# Altium schematic sheet 07_Connector.SchDoc
size A3; SheetNumber: 7; SheetTotal: 7
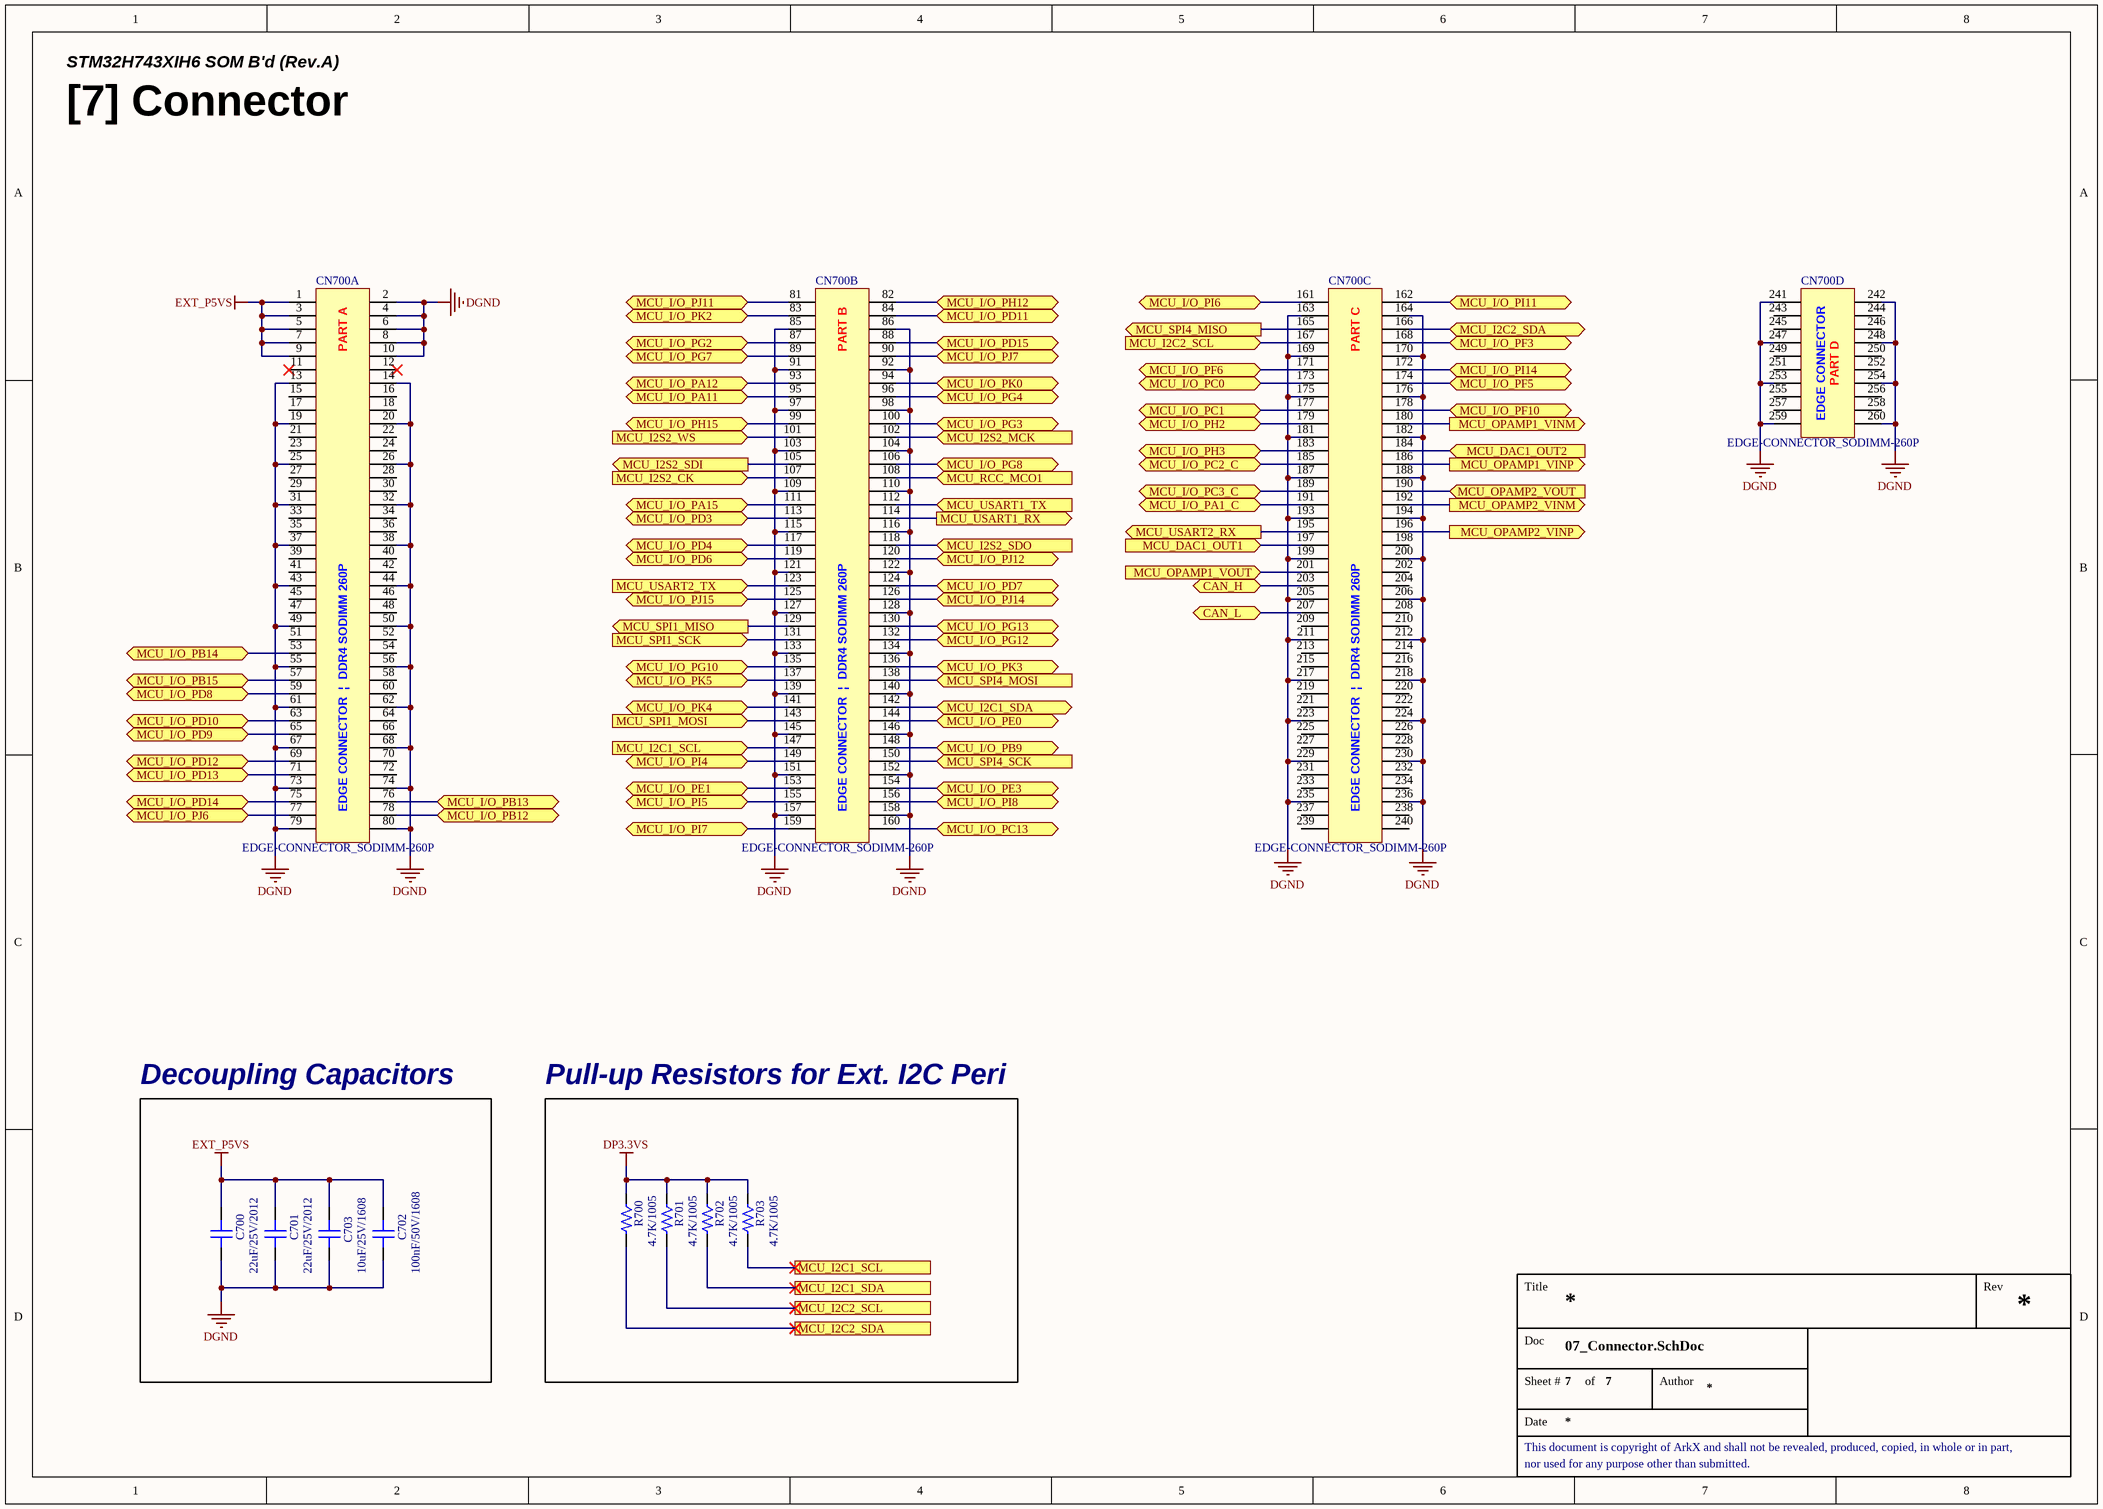
[diagram p0: 07_Connector.SchDoc]

## Parts
C700  22uF/25V/2012  [CAP 2012 (0805_INCH)]
C701  22uF/25V/2012  [CAP 2012 (0805_INCH)]
C702  100nF/50V/1608  [CAP 1608 (0603_INCH)]
C703  10uF/25V/1608  [CAP 1608 (0603_INCH)]
CN700  EDGE-CONNECTOR_SODIMM-260P  [CON_EDGE-CONNECTOR_DDR4-SODIMM-260P]  (parts A,B,C,D of 4)
R700  4.7K/1005  [RES 1005 (0402_inch)]
R701  4.7K/1005  [RES 1005 (0402_inch)]
R702  4.7K/1005  [RES 1005 (0402_inch)]
R703  4.7K/1005  [RES 1005 (0402_inch)]

## Blocks framed on the sheet
Decoupling Capacitors: C700-C703
Pull-up Resistors for Ext. I2C Peri: R700-R703

## Ports
CAN_H (bidir), CAN_L (bidir), MCU_DAC1_OUT1 (in), MCU_DAC1_OUT2 (in), MCU_I2C1_SCL, MCU_I2C1_SCL (in), MCU_I2C1_SDA, MCU_I2C1_SDA (bidir), MCU_I2C2_SCL, MCU_I2C2_SCL (in), MCU_I2C2_SDA, MCU_I2C2_SDA (bidir), MCU_I2S2_CK (in), MCU_I2S2_MCK (in), MCU_I2S2_SDI (out), MCU_I2S2_SDO (in), MCU_I2S2_WS (in), MCU_I/O_PA1_C (bidir), MCU_I/O_PA11 (bidir), MCU_I/O_PA12 (bidir), MCU_I/O_PA15 (bidir), MCU_I/O_PB9 (bidir), MCU_I/O_PB12 (bidir), MCU_I/O_PB13 (bidir), MCU_I/O_PB14 (bidir), MCU_I/O_PB15 (bidir), MCU_I/O_PC0 (bidir), MCU_I/O_PC1 (bidir), MCU_I/O_PC2_C (bidir), MCU_I/O_PC3_C (bidir), MCU_I/O_PC13 (bidir), MCU_I/O_PD3 (bidir), MCU_I/O_PD4 (bidir), MCU_I/O_PD6 (bidir), MCU_I/O_PD7 (bidir), MCU_I/O_PD8 (bidir), MCU_I/O_PD9 (bidir), MCU_I/O_PD10 (bidir), MCU_I/O_PD11 (bidir), MCU_I/O_PD12 (bidir), MCU_I/O_PD13 (bidir), MCU_I/O_PD14 (bidir), MCU_I/O_PD15 (bidir), MCU_I/O_PE0 (bidir), MCU_I/O_PE1 (bidir), MCU_I/O_PE3 (bidir), MCU_I/O_PF3 (bidir), MCU_I/O_PF5 (bidir), MCU_I/O_PF6 (bidir), MCU_I/O_PF10 (bidir), MCU_I/O_PG2 (bidir), MCU_I/O_PG3 (bidir), MCU_I/O_PG4 (bidir), MCU_I/O_PG7 (bidir), MCU_I/O_PG8 (bidir), MCU_I/O_PG10 (bidir), MCU_I/O_PG12 (bidir), MCU_I/O_PG13 (bidir), MCU_I/O_PH2 (bidir), MCU_I/O_PH3 (bidir), MCU_I/O_PH12 (bidir), MCU_I/O_PH15 (bidir), MCU_I/O_PI4 (bidir), MCU_I/O_PI5 (bidir), MCU_I/O_PI6 (bidir), MCU_I/O_PI7 (bidir), MCU_I/O_PI8 (bidir), MCU_I/O_PI11 (bidir), MCU_I/O_PI14 (bidir), MCU_I/O_PJ6 (bidir), MCU_I/O_PJ7 (bidir), MCU_I/O_PJ11 (bidir), MCU_I/O_PJ12 (bidir), MCU_I/O_PJ14 (bidir), MCU_I/O_PJ15 (bidir), MCU_I/O_PK0 (bidir), MCU_I/O_PK2 (bidir), MCU_I/O_PK3 (bidir), MCU_I/O_PK4 (bidir), MCU_I/O_PK5 (bidir), MCU_OPAMP1_VINM (out), MCU_OPAMP1_VINP (out), MCU_OPAMP1_VOUT (in), MCU_OPAMP2_VINM (out), MCU_OPAMP2_VINP (out), MCU_OPAMP2_VOUT (in), MCU_RCC_MCO1 (in), MCU_SPI1_MISO (out), MCU_SPI1_MOSI (in), MCU_SPI1_SCK (in), MCU_SPI4_MISO (out), MCU_SPI4_MOSI (in), MCU_SPI4_SCK (in), MCU_USART1_RX (out), MCU_USART1_TX (in), MCU_USART2_RX (out), MCU_USART2_TX (in)

## Nets
DGND: C700.1 C701.1 C702.1 C703.1 CN700.2 CN700.4 CN700.6 CN700.8 CN700.10 CN700.13 CN700.14 CN700.19 CN700.20 CN700.25 CN700.26 CN700.31 CN700.32 CN700.37 CN700.38 CN700.43 CN700.44 CN700.49 CN700.50 CN700.55 CN700.56 CN700.61 CN700.62 CN700.67 CN700.68 CN700.73 CN700.74 CN700.79 CN700.80 CN700.85 CN700.86 CN700.91 CN700.92 CN700.97 CN700.98 CN700.103 CN700.104 CN700.109 CN700.110 CN700.115 CN700.116 CN700.121 CN700.122 CN700.127 CN700.128 CN700.133 CN700.134 CN700.139 CN700.140 CN700.145 CN700.146 CN700.151 CN700.152 CN700.157 CN700.158 CN700.163 CN700.164 CN700.169 CN700.170 CN700.175 CN700.176 CN700.181 CN700.182 CN700.187 CN700.188 CN700.193 CN700.194 CN700.199 CN700.200 CN700.205 CN700.206 CN700.211 CN700.212 CN700.217 CN700.218 CN700.223 CN700.224 CN700.229 CN700.230 CN700.235 CN700.236 CN700.241 CN700.242 CN700.247 CN700.248 CN700.253 CN700.254 CN700.259 CN700.260
DP3.3VS: R700.1 R701.1 R702.1 R703.1
EXT_P5VS: C700.2 C701.2 C702.2 C703.2 CN700.1 CN700.3 CN700.5 CN700.7 CN700.9
CAN_H: CN700.203 ; port CAN_H
CAN_L: CN700.207 ; port CAN_L
MCU_DAC1_OUT1: CN700.197 ; port MCU_DAC1_OUT1
MCU_DAC1_OUT2: CN700.184 ; port MCU_DAC1_OUT2
MCU_I2C1_SCL: CN700.147 R703.2 ; port MCU_I2C1_SCL
MCU_I2C1_SDA: CN700.142 R702.2 ; port MCU_I2C1_SDA
MCU_I2C2_SCL: CN700.167 R701.2 ; port MCU_I2C2_SCL
MCU_I2C2_SDA: CN700.166 R700.2 ; port MCU_I2C2_SDA
MCU_I2S2_CK: CN700.107 ; port MCU_I2S2_CK
MCU_I2S2_MCK: CN700.102 ; port MCU_I2S2_MCK
MCU_I2S2_SDI: CN700.105 ; port MCU_I2S2_SDI
MCU_I2S2_SDO: CN700.118 ; port MCU_I2S2_SDO
MCU_I2S2_WS: CN700.101 ; port MCU_I2S2_WS
MCU_I/O_PA1_C: CN700.191 ; port MCU_I/O_PA1_C
MCU_I/O_PA11: CN700.95 ; port MCU_I/O_PA11
MCU_I/O_PA12: CN700.93 ; port MCU_I/O_PA12
MCU_I/O_PA15: CN700.111 ; port MCU_I/O_PA15
MCU_I/O_PB9: CN700.148 ; port MCU_I/O_PB9
MCU_I/O_PB12: CN700.78 ; port MCU_I/O_PB12
MCU_I/O_PB13: CN700.76 ; port MCU_I/O_PB13
MCU_I/O_PB14: CN700.53 ; port MCU_I/O_PB14
MCU_I/O_PB15: CN700.57 ; port MCU_I/O_PB15
MCU_I/O_PC0: CN700.173 ; port MCU_I/O_PC0
MCU_I/O_PC1: CN700.177 ; port MCU_I/O_PC1
MCU_I/O_PC2_C: CN700.185 ; port MCU_I/O_PC2_C
MCU_I/O_PC3_C: CN700.189 ; port MCU_I/O_PC3_C
MCU_I/O_PC13: CN700.160 ; port MCU_I/O_PC13
MCU_I/O_PD3: CN700.113 ; port MCU_I/O_PD3
MCU_I/O_PD4: CN700.117 ; port MCU_I/O_PD4
MCU_I/O_PD6: CN700.119 ; port MCU_I/O_PD6
MCU_I/O_PD7: CN700.124 ; port MCU_I/O_PD7
MCU_I/O_PD8: CN700.59 ; port MCU_I/O_PD8
MCU_I/O_PD9: CN700.65 ; port MCU_I/O_PD9
MCU_I/O_PD10: CN700.63 ; port MCU_I/O_PD10
MCU_I/O_PD11: CN700.84 ; port MCU_I/O_PD11
MCU_I/O_PD12: CN700.69 ; port MCU_I/O_PD12
MCU_I/O_PD13: CN700.71 ; port MCU_I/O_PD13
MCU_I/O_PD14: CN700.75 ; port MCU_I/O_PD14
MCU_I/O_PD15: CN700.88 ; port MCU_I/O_PD15
MCU_I/O_PE0: CN700.144 ; port MCU_I/O_PE0
MCU_I/O_PE1: CN700.153 ; port MCU_I/O_PE1
MCU_I/O_PE3: CN700.154 ; port MCU_I/O_PE3
MCU_I/O_PF3: CN700.168 ; port MCU_I/O_PF3
MCU_I/O_PF5: CN700.174 ; port MCU_I/O_PF5
MCU_I/O_PF6: CN700.171 ; port MCU_I/O_PF6
MCU_I/O_PF10: CN700.178 ; port MCU_I/O_PF10
MCU_I/O_PG2: CN700.87 ; port MCU_I/O_PG2
MCU_I/O_PG3: CN700.100 ; port MCU_I/O_PG3
MCU_I/O_PG4: CN700.96 ; port MCU_I/O_PG4
MCU_I/O_PG7: CN700.89 ; port MCU_I/O_PG7
MCU_I/O_PG8: CN700.106 ; port MCU_I/O_PG8
MCU_I/O_PG10: CN700.135 ; port MCU_I/O_PG10
MCU_I/O_PG12: CN700.132 ; port MCU_I/O_PG12
MCU_I/O_PG13: CN700.130 ; port MCU_I/O_PG13
MCU_I/O_PH2: CN700.179 ; port MCU_I/O_PH2
MCU_I/O_PH3: CN700.183 ; port MCU_I/O_PH3
MCU_I/O_PH12: CN700.82 ; port MCU_I/O_PH12
MCU_I/O_PH15: CN700.99 ; port MCU_I/O_PH15
MCU_I/O_PI4: CN700.149 ; port MCU_I/O_PI4
MCU_I/O_PI5: CN700.155 ; port MCU_I/O_PI5
MCU_I/O_PI6: CN700.161 ; port MCU_I/O_PI6
MCU_I/O_PI7: CN700.159 ; port MCU_I/O_PI7
MCU_I/O_PI8: CN700.156 ; port MCU_I/O_PI8
MCU_I/O_PI11: CN700.162 ; port MCU_I/O_PI11
MCU_I/O_PI14: CN700.172 ; port MCU_I/O_PI14
MCU_I/O_PJ6: CN700.77 ; port MCU_I/O_PJ6
MCU_I/O_PJ7: CN700.90 ; port MCU_I/O_PJ7
MCU_I/O_PJ11: CN700.81 ; port MCU_I/O_PJ11
MCU_I/O_PJ12: CN700.120 ; port MCU_I/O_PJ12
MCU_I/O_PJ14: CN700.126 ; port MCU_I/O_PJ14
MCU_I/O_PJ15: CN700.125 ; port MCU_I/O_PJ15
MCU_I/O_PK0: CN700.94 ; port MCU_I/O_PK0
MCU_I/O_PK2: CN700.83 ; port MCU_I/O_PK2
MCU_I/O_PK3: CN700.136 ; port MCU_I/O_PK3
MCU_I/O_PK4: CN700.141 ; port MCU_I/O_PK4
MCU_I/O_PK5: CN700.137 ; port MCU_I/O_PK5
MCU_OPAMP1_VINM: CN700.180 ; port MCU_OPAMP1_VINM
MCU_OPAMP1_VINP: CN700.186 ; port MCU_OPAMP1_VINP
MCU_OPAMP1_VOUT: CN700.201 ; port MCU_OPAMP1_VOUT
MCU_OPAMP2_VINM: CN700.192 ; port MCU_OPAMP2_VINM
MCU_OPAMP2_VINP: CN700.196 ; port MCU_OPAMP2_VINP
MCU_OPAMP2_VOUT: CN700.190 ; port MCU_OPAMP2_VOUT
MCU_RCC_MCO1: CN700.108 ; port MCU_RCC_MCO1
MCU_SPI1_MISO: CN700.129 ; port MCU_SPI1_MISO
MCU_SPI1_MOSI: CN700.143 ; port MCU_SPI1_MOSI
MCU_SPI1_SCK: CN700.131 ; port MCU_SPI1_SCK
MCU_SPI4_MISO: CN700.165 ; port MCU_SPI4_MISO
MCU_SPI4_MOSI: CN700.138 ; port MCU_SPI4_MOSI
MCU_SPI4_SCK: CN700.150 ; port MCU_SPI4_SCK
MCU_USART1_RX: CN700.114 ; port MCU_USART1_RX
MCU_USART1_TX: CN700.112 ; port MCU_USART1_TX
MCU_USART2_RX: CN700.195 ; port MCU_USART2_RX
MCU_USART2_TX: CN700.123 ; port MCU_USART2_TX

Not connected (* = marked no-connect by the designer): CN700 11* 12* 15 16 17 18 21 22 23 24 27 28 29 30 33 34 35 36 39 40 41 42 45 46 47 48 51 52 54 58 60 64 66 70 72 198 202 204 208 209 210 213 214 215 216 219 220 221 222 225 226 227 228 231 232 233 234 237 238 239 240 243 244 245 246 249 250 251 252 255 256 257 258

## Notes on the sheet
- STM32H743XIH6 SOM B'd (Rev.A)
- [7] Connector
- Title
- Rev
- Doc
- Sheet #
- of
- Author
- This document is copyright of ArkX and shall not be revealed, produced, copied, in whole or in part,
- Date
- nor used for any purpose other than submitted.
- (in symbol CON_EDGE-CONNECTOR_DDR4-SODIMM-260P, part A) PART A; EDGE CONNECTOR  |  DDR4 SODIMM 260P
- (in symbol CON_EDGE-CONNECTOR_DDR4-SODIMM-260P, part B) PART B; EDGE CONNECTOR  |  DDR4 SODIMM 260P
- (in symbol CON_EDGE-CONNECTOR_DDR4-SODIMM-260P, part C) PART C; EDGE CONNECTOR  |  DDR4 SODIMM 260P
- (in symbol CON_EDGE-CONNECTOR_DDR4-SODIMM-260P, part D) EDGE CONNECTOR; PART D

## Library data of the parts
C700 C701 = CAP_22uF/25V/2012: Ceramic CAP_22uF/25V/2012; LCSC Part #: C45783; JLCPCB Part Type: Basic Part
C702 = CAP_100nF/50V/1608: Ceramic CAP_100nF/50V/1608; LCSC Part #: C14663; JLCPCB Part Type: Basic Part
C703 = CAP_10uF/25V/1608: Ceramic CAP_10uF/25V/1608; LCSC Part #: C96446; JLCPCB Part Type: Basic Part
CN700 = CON_EDGE-CONNECTOR_DDR4-SODIMM-260P: EDGE-CONNECTOR_DDR4-SODIMM-260P; Mating Part Number: 2309409-1
R700-R703 = RES_4.7K/1005/62.5mW: Value: 4.7K; Power Rating: 62.5mW; Precision: 1%; Size: 1005; LCSC Part #: C25900; JLCPCB Part Type: Basic Part